# Altium project make-urine-white.PrjPcb
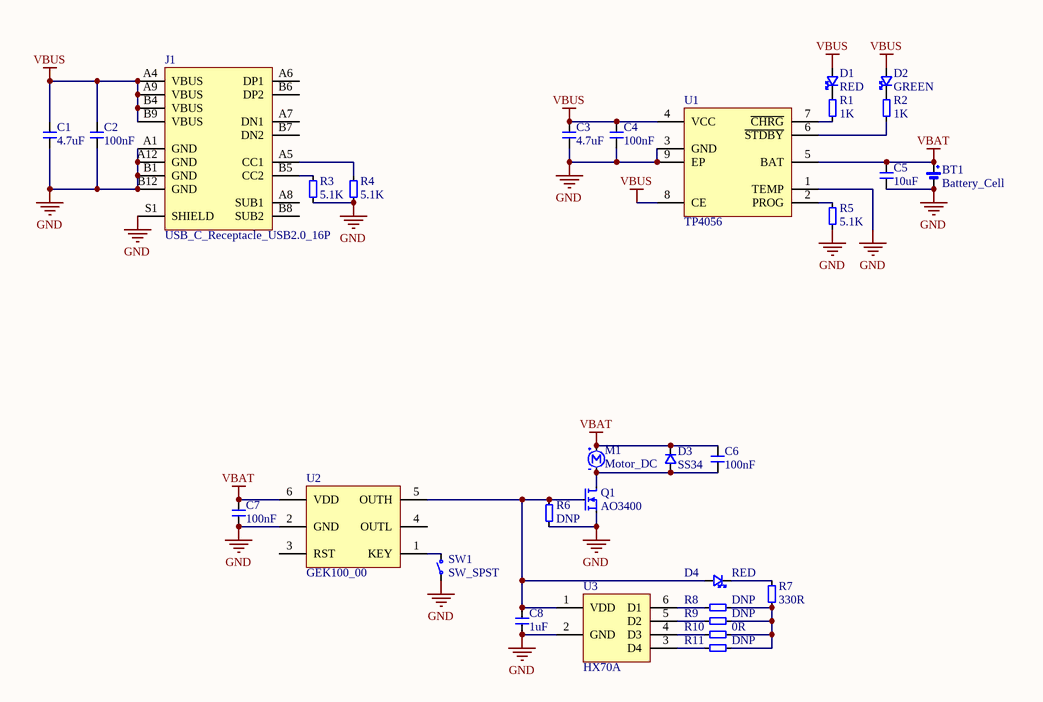
[diagram p0: Main.SchDoc]
1 sheet, 31 parts. Net scope: global (net labels, ports and power ports of the same name join across sheets).
Board file: make-urine-white.PcbDoc

## Sheet Main.SchDoc
size A4; SheetNumber: 1; SheetTotal: 1

### Parts
BT1  Battery_Cell  [WAFER-PH2.0-2PWB]
C1  4.7uF  [C_0603_1608Metric]
C2  100nF  [C_0402_1005Metric]
C3  4.7uF  [C_0603_1608Metric]
C4  100nF  [C_0402_1005Metric]
C5  10uF  [C_0603_1608Metric]
C6  100nF  [C_0402_1005Metric]
C7  100nF  [C_0402_1005Metric]
C8  1uF  [C_0603_1608Metric]
D1  RED  [LED_0603_1608Metric]
D2  GREEN  [LED_0603_1608Metric]
D3  SS34  [D_SMA]
D4  RED  [LED_0603_1608Metric]
J1  USB_C_Receptacle_USB2.0_16P  [USB_C_Receptacle_GCT_USB4105-xx-A_16P_TopMnt_Horizontal]
M1  Motor_DC  [Motor-HJD-3.7V-500mA]
Q1  AO3400  [SOT-23-3]
R1  1K  [R_0402_1005Metric]
R2  1K  [R_0402_1005Metric]
R3  5.1K  [R_0402_1005Metric]
R4  5.1K  [R_0402_1005Metric]
R5  5.1K  [R_0402_1005Metric]
R6  DNP  [R_0402_1005Metric]
R7  330R  [R_0402_1005Metric]
R8  DNP  [R_0402_1005Metric]
R9  DNP  [R_0402_1005Metric]
R10  0R  [R_0402_1005Metric]
R11  DNP  [R_0402_1005Metric]
SW1  SW_SPST  [SW_PUSH_6mm_H5mm]
U1  TP4056  [EMSOP-8-1EP_3x3mm_P0.65mm_EP1.7x1.9mm]
U2  GEK100_00  [SOT-23-6]
U3  HX70A  [SOT-23-6]

### Nets
GND: BT1.1 C1.2 C2.2 C3.2 C4.2 C5.2 C7.2 C8.2 J1.A1(GND) J1.A12(GND) J1.B1(GND) J1.B12(GND) J1.S1(SHIELD) Q1.2(S) R3.2 R4.2 R5.2 R6.2 SW1.1 U1.1(TEMP) U1.3(GND) U1.9(EP) U2.2(GND) U3.2(GND)
VBAT: BT1.2 C5.1 C6.1 C7.1 D3.1 M1.1 U1.5(BAT) U2.6(VDD)
VBUS: C1.1 C2.1 C3.1 C4.1 D1.2(A) D2.2(A) J1.A4(VBUS) J1.A9(VBUS) J1.B4(VBUS) J1.B9(VBUS) U1.4(VCC) U1.8(CE)
NetC6_2: C6.2 D3.2 M1.2 Q1.3(D)
NetC8_1: C8.1 D4.2(A) Q1.1(G) R6.1 U2.5(OUTH) U3.1(VDD)
NetD1_1: D1.1(K) R1.1
NetD2_1: D2.1(K) R2.1
NetD4_1: D4.1(K) R7.2
NetJ1_A5: J1.A5(CC1) R4.1
NetJ1_B5: J1.B5(CC2) R3.1
NetR1_2: R1.2 U1.7(~{CHRG})
NetR2_2: R2.2 U1.6(~{STDBY})
NetR5_1: R5.1 U1.2(PROG)
NetR7_1: R7.1 R8.2 R9.2 R10.2 R11.2
NetR8_1: R8.1 U3.6(D1)
NetR9_1: R9.1 U3.5(D2)
NetR10_1: R10.1 U3.4(D3)
NetR11_1: R11.1 U3.3(D4)
NetSW1_2: SW1.2 U2.1(KEY)

Not connected (* = marked no-connect by the designer): J1 A6(DP1) A7(DN1) A8(SUB1) B6(DP2) B7(DN2) B8(SUB2); U2 3(RST) 4(OUTL)

### Library data of the parts
BT1 = Battery_Cell: Single-cell battery
C1-C8 = C: Unpolarized capacitor
D1 D2 D4 = LED: Light emitting diode
D3 = D: diode
J1 = USB_C_Receptacle_USB2.0_16P: USB 2.0-only 16P Type-C Receptacle connector
M1 = Motor_DC: DC Motor
Q1 = Q_NMOS_GSD: N-MOSFET transistor, gate/source/drain
R1-R11 = R: Resistor
SW1 = SW_SPST: Single Pole Single Throw (SPST) switch
U1 = TP4056: 1A Standalone Linear Li-ion/LiPo single-cell battery charger, 4.2V ±1% charge voltage, VCC = 4.0..8.0V, ESOP-8, EMSOP-8
U2 = GEK100_xx: Push-button power controller, hardware on/off, SOT-23-6
U3 = HX70A: 4-level battery voltage indicator for single-cell Li-ion, thresholds at 3.1V/3.5V/3.64V/3.8V, SOT-23-6